# Altium schematic sheet 温湿度控制.SCHDOC
size A4
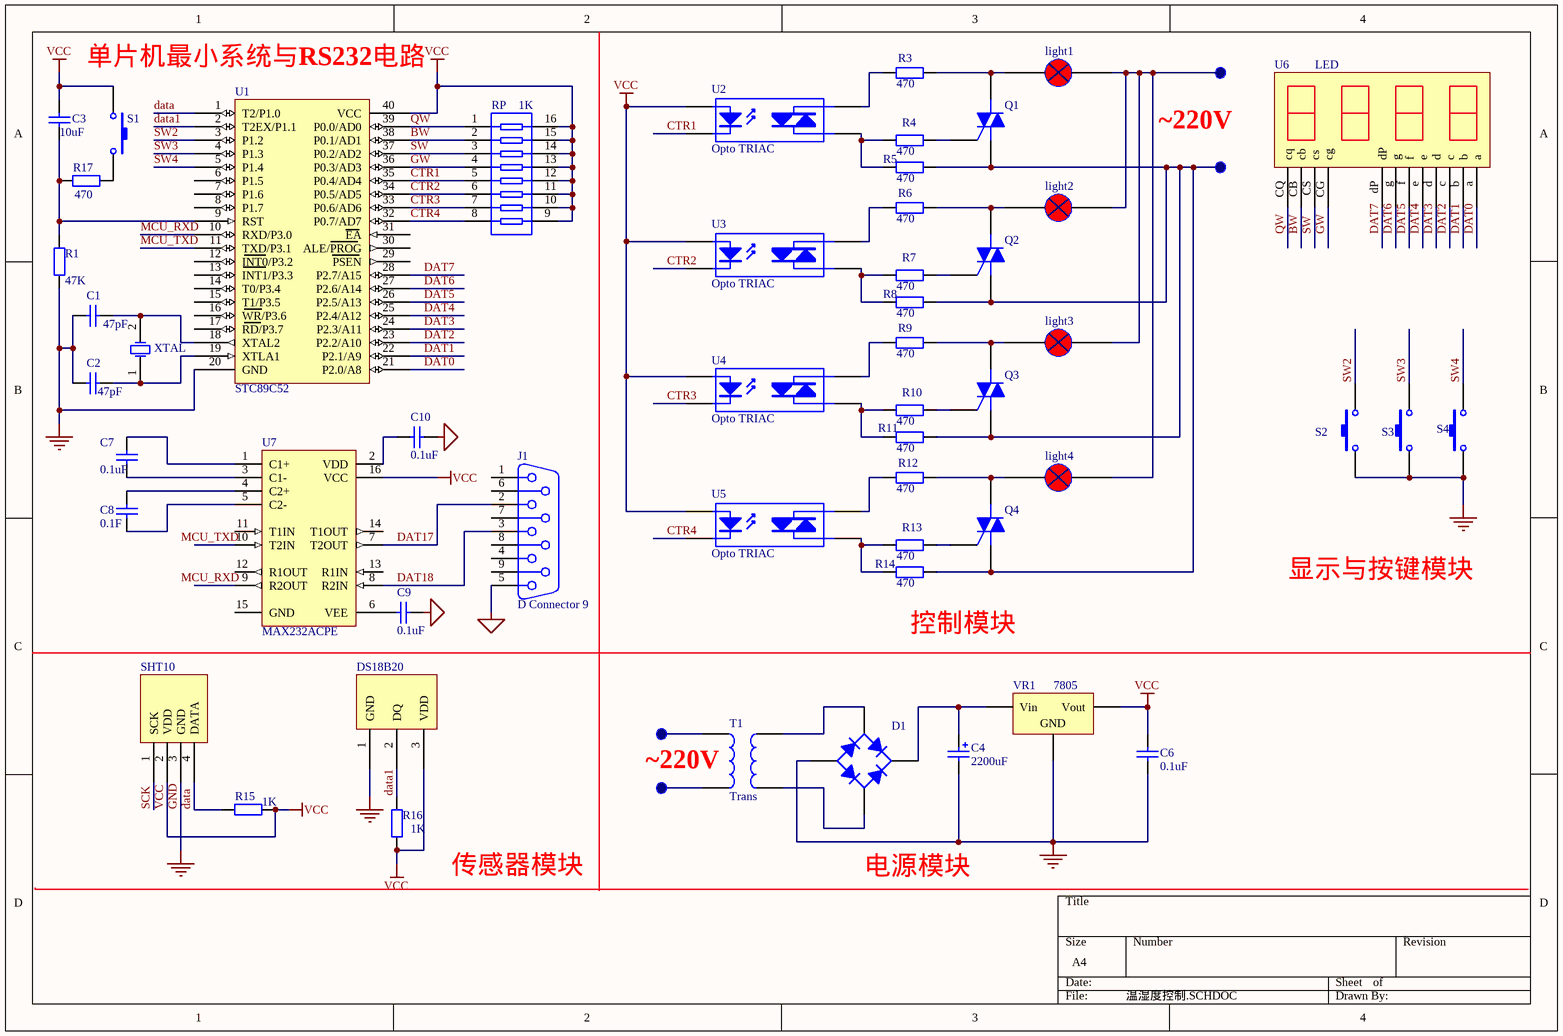
[diagram p0: 温湿度控制.SCHDOC]

## Parts
?  SHT10
C1  value 47pF  [RAD-0.3]
C2  value 47pF  [RAD-0.3]
C3  value 10uF  [RAD-0.3]
C4  value 2200uF  [RB7.6-15]
C6  value 0.1uF  [RAD-0.3]
C7  value 0.1uF  [RAD-0.3]
C8  value 0.1F  [RAD-0.3]
C9  value 0.1uF  [RAD-0.3]
C10  value 0.1uF  [RAD-0.3]
D1  (no value)  [E-BIP-P4/D10]
DS18B20  (no value)
J1  D Connector 9  [DSUB1.385-2H9]
light1  (no value)
light2  (no value)
light3  (no value)
light4  (no value)
Q1  (no value)  [SFM-T3/A2.4V]
Q2  (no value)  [SFM-T3/A2.4V]
Q3  (no value)  [SFM-T3/A2.4V]
Q4  (no value)  [SFM-T3/A2.4V]
R1  value 47K  [AXIAL-0.4]
R3  value 470  [AXIAL-0.4]
R4  value 470  [AXIAL-0.4]
R5  value 470  [AXIAL-0.4]
R6  value 470  [AXIAL-0.4]
R7  value 470  [AXIAL-0.4]
R8  value 470  [AXIAL-0.4]
R9  value 470  [AXIAL-0.4]
R10  value 470  [AXIAL-0.4]
R11  value 470  [AXIAL-0.4]
R12  value 470  [AXIAL-0.4]
R13  value 470  [AXIAL-0.4]
R14  value 470  [AXIAL-0.4]
R15  value 1K  [AXIAL-0.4]
R16  value 1K  [AXIAL-0.4]
R17  value 470  [AXIAL-0.4]
RP  value 1K  [SSO-G16/X.4]
S1  (no value)  [SPST-2]
S2  (no value)  [SPST-2]
S3  (no value)  [SPST-2]
S4  (no value)  [SPST-2]
T1  Trans  [TRANS]
U1  STC89C52
U2  Opto TRIAC  [SIP-P4/A7.5]
U3  Opto TRIAC  [SIP-P4/A7.5]
U4  Opto TRIAC  [SIP-P4/A7.5]
U5  Opto TRIAC  [SIP-P4/A7.5]
U6  LED
U7  MAX232ACPE  [PE16A]
VR1  7805  [SIP-G3/Y2]
XTAL  (no value)  [BCY-W2/D3.1]

## Nets
GND: ?.3(GND) C1.1 C2.1 C4.2 C6.1 C9.2 C10.2 D1.1(A) DS18B20.1(GND) J1.5 R1.1 S2.1 S3.1 S4.1 U1.20(GND) VR1.2(GND)
VCC: ?.2(VDD) C3.2 C6.2 DS18B20.3(VDD) R15.1 R16.1 RP.9 RP.10 RP.11 RP.12 RP.13 RP.14 RP.15 RP.16 S1.1 U1.40(VCC) U2.1(A) U3.1(A) U4.1(A) U5.1(A) U7.16(VCC) VR1.3(Vout)
BW: RP.2 U1.38(P0.1/AD1) U6.CB(cb)
CTR1: RP.5 U1.35(P0.4/AD4) U2.2(K)
CTR2: RP.6 U1.34(P0.5/AD5) U3.2(K)
CTR3: RP.7 U1.33(P0.6/AD6) U4.2(K)
CTR4: RP.8 U1.32(P0.7/AD7) U5.2(K)
DAT0: U1.21(P2.0/A8) U6.a
DAT1: U1.22(P2.1/A9) U6.b
DAT2: U1.23(P2.2/A10) U6.c
DAT3: U1.24(P2.3/A11) U6.d
DAT4: U1.25(P2.4/A12) U6.e
DAT5: U1.26(P2.5/A13) U6.f
DAT6: U1.27(P2.6/A14) U6.g
DAT7: U1.28(P2.7/A15) U6.dP
DAT17: J1.2 U7.7(T2OUT)
DAT18: J1.3 U7.8(R2IN)
data: ?.4(DATA) R15.2 U1.1(T2/P1.0)
data1: DS18B20.2(DQ) R16.2 U1.2(T2EX/P1.1)
GW: RP.4 U1.36(P0.3/AD3) U6.CG(cg)
MCU_RXD: U1.10(RXD/P3.0)
MCU_TXD: U1.11(TXD/P3.1)
QW: RP.1 U1.39(P0.0/AD0) U6.CQ(cq)
SCK: ?.1(SCK)
SW: RP.3 U1.37(P0.2/AD2) U6.CS(cs)
SW2: S2.2 U1.3(P1.2)
SW3: S3.2 U1.4(P1.3)
SW4: S4.2 U1.5(P1.4)
NetC1_2: C1.2 U1.18(XTAL2) XTAL.2(OSC2)
NetC2_2: C2.2 U1.19(XTLA1) XTAL.1(OSC1)
NetC3_1: C3.1 R1.2 R17.1 U1.9(RST)
NetC4_1: C4.1 D1.3(K) VR1.1(Vin)
NetC7_1: C7.1 U7.3(C1-)
NetC7_2: C7.2 U7.1(C1+)
NetC8_1: C8.1 U7.5(C2-)
NetC8_2: C8.2 U7.4(C2+)
NetC9_1: C9.1 U7.6(VEE)
NetC10_1: C10.1 U7.2(VDD)
NetD1_2: D1.2(C) T1.3
NetD1_4: D1.4(C) T1.4
NetQ1_1: Q1.1(M1) Q2.1(M1) Q3.1(M1) Q4.1(M1) R5.2 R8.2 R11.2 R14.2
NetQ1_2: Q1.2(M2) R3.2
NetQ1_3: Q1.3(G) R4.2
NetQ2_2: Q2.2(M2) R6.2
NetQ2_3: Q2.3(G) R7.2
NetQ3_2: Q3.2(M2) R9.2
NetQ3_3: Q3.3(G) R10.2
NetQ4_2: Q4.2(M2) R12.2
NetQ4_3: Q4.3(G) R13.2
NetR3_1: R3.1 U2.3(A/K)
NetR4_1: R4.1 R5.1 U2.4(A/K)
NetR6_1: R6.1 U3.3(A/K)
NetR7_1: R7.1 R8.1 U3.4(A/K)
NetR9_1: R9.1 U4.3(A/K)
NetR10_1: R10.1 R11.1 U4.4(A/K)
NetR12_1: R12.1 U5.3(A/K)
NetR13_1: R13.1 R14.1 U5.4(A/K)
NetR17_2: R17.2 S1.2

Not connected (* = marked no-connect by the designer): J1 1 4 6 7 8 9; light1 ?1 ?2; light2 ?1 ?2; light3 ?1 ?2; light4 ?1 ?2; T1 1 2; U1 6(P1.5) 7(P1.6) 8(P1.7) 12(INT0/P3.2) 13(INT1/P3.3) 14(T0/P3.4) 15(T1/P3.5) 16(WR/P3.6) 17(RD/P3.7) 29(PSEN) 30(ALE/PROG) 31(EA); U7 9(R2OUT) 10(T2IN) 11(T1IN) 12(R1OUT) 13(R1IN) 14(T1OUT) 15(GND)

## Notes on the sheet
- 单片机最小系统与RS232电路
- ~220V
- 显示与按键模块
- (near R14) 控制模块
- (near T1) ~220V
- 传感器模块
- 电源模块
- Labels drawn without touching a wire or pin: MCU_RXD, MCU_TXD

## Library data of the parts
C1-C3 C6-C10 = Cap: Capacitor; Published: 8-Jun-2000; Revision: July-2002: Re-released for DXP Platform.; Publisher: Altium Limited
C4 = Cap Pol1: Polarized Capacitor (Radial); Published: 8-Jun-2000; Revision: July-2002: Re-released for DXP Platform.; Publisher: Altium Limited
D1 = Bridge1: Full Wave Diode Bridge; Published: 8-Jun-2000; Revision: July-2002: Re-released for DXP Platform.; Publisher: Altium Limited
DS18B20 = DS18B20
J1 = D Connector 9: Receptacle Assembly, 9 Position, Right Angle; Package Information: Latest Revision: O; Positions: 9; Published: 15-Jun-2001; Revision: 17-Jul-2002: Re-released for DXP Platform.; Datasheet: (1-Sep-1999); Package Reference: 788750; Publisher: Altium Limited; Orientation: Right Angle; Gender: Receptacle
light1-light4 = light
Q1-Q4 = Triac: Silicon Bidirectional Triode Thyristor; Note: Pin 2 is electrically connected to Pin 4 (TAB); Code - JEDEC: TO-251-AA; Published: 29-Sep-2000; Revision: July-2002: Re-released for DXP Platform.; Datasheet: Latest Revision: 1999; Package Reference: 221A-09; Publisher: Altium Limited
R1 R3-R17 = Res2: Resistor; Published: 8-Jun-2000; Revision: July-2002: Re-released for DXP Platform.; Publisher: Altium Limited
RP = Res Pack4: Resistor Array; Code - JEDEC: MO-150-AC; Published: 24-Mar-1999; Revision: July-2002: Re-released for DXP Platform.; Publisher: Altium Limited
S1-S4 = SW-PB: Switch; Published: 24-Mar-1999; Revision: July-2002: Re-released for DXP Platform.; Publisher: Altium Limited
T1 = Trans: Transformer; Published: 24-Mar-1999; Revision: July-2002: Re-released for DXP Platform.; Publisher: Altium Limited
U2-U5 = Opto TRIAC: Opto-Triac; Published: 24-Mar-1999; Revision: July-2002: Re-released for DXP Platform.; Publisher: Altium Limited
U7 = MAX232ACPE: +5V Powered, Multi-Channel RS-232 Driver/Receiver; pin to pad: 10>11 11>10; Package Information: Latest Revision: 1997; Code - JEDEC: MS-001-BB; Published: 16-Jan-2001; Revision: 17-Jul-2002: Re-released for DXP Platform.; Package Reference: PE16A; Publisher: Altium Limited
VR1 = Volt Reg: Voltage Regulator; Code - JEDEC: SMD-220; Published: 24-Mar-1999; Revision: July-2002: Re-released for DXP Platform.; Publisher: Altium Limited
XTAL = XTAL: Crystal Oscillator; Published: 8-Jun-2000; Revision: July-2002: Re-released for DXP Platform.; Publisher: Altium Limited